# EAGLE design honeywell-mpr-breakout (EAGLE 9.3.0)
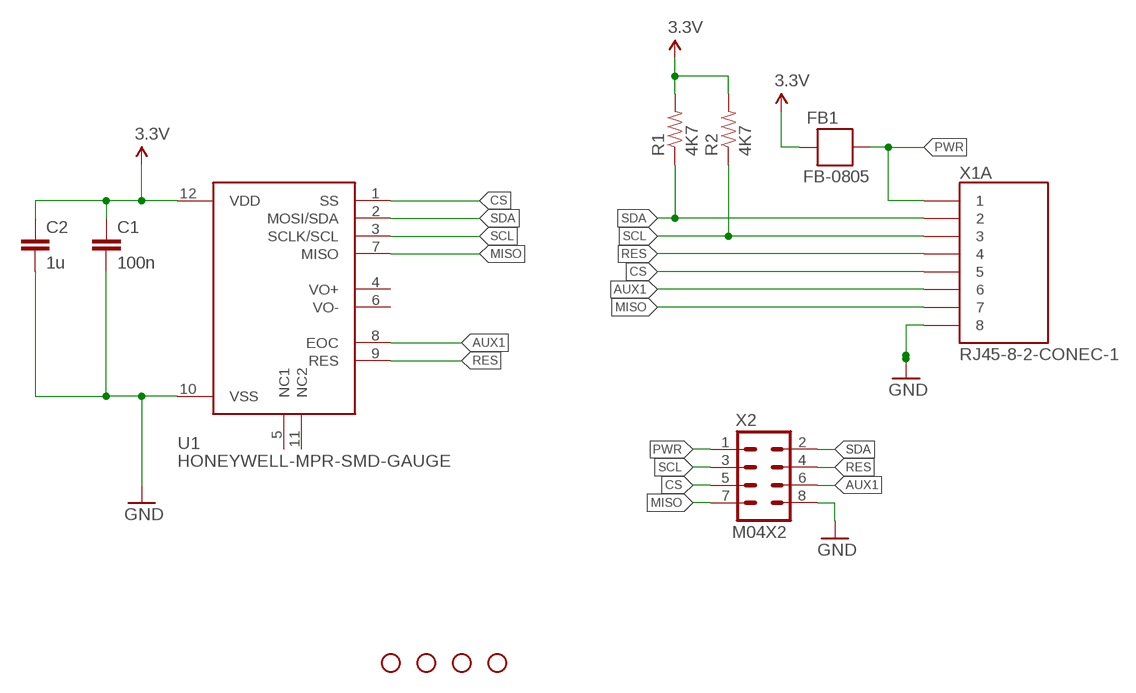
[diagram p0: schematic, sheet 1]

## Parts
C1  100n  CAP0805  [0805]
C2  1u  CAP0805  [0805]
FB1  FB-0805  [0805]
JP1  STAND-OFF  [STAND-OFF]
JP2  STAND-OFF  [STAND-OFF]
JP3  STAND-OFF  [STAND-OFF]
JP4  STAND-OFF  [STAND-OFF]
R1  4K7  RESISTOR0805-RES  [0805]
R2  4K7  RESISTOR0805-RES  [0805]
U1  HONEYWELL-MPR-SMD-GAUGE  [HONEYWELL-MPR-GAUGE]
X1  RJ45-8-2-CONEC-1  [CONEC-33TS3004ST-88001]
X2  M04X2  [2X4]

## Nets
3.3V: C1.1 C2.1 FB1.2 R1.2 R2.2 U1.12(VDD)
AUX1: U1.8(EOC) X1.6 X2.6
CS: U1.1(SS) X1.5 X2.5
GND: C1.2 C2.2 U1.10(VSS) X1.8 X1.M1 X1.M2 X2.8
MISO: U1.7(MISO) X1.7 X2.7
PWR: FB1.1 X1.1 X2.1
RES: U1.9(RES) X1.4 X2.4
SCL: R2.1 U1.3(SCLK/SCL) X1.3 X2.3
SDA: R1.1 U1.2(MOSI/SDA) X1.2 X2.2
Unconnected: U1.4(VO+) U1.5(NC1) U1.6(VO-) U1.11(NC2)

## Library data of the parts
C1 C2 = apollo-ctrl:CAP: Capacitor Standard 0603 ceramic capacitor, and 0.1" leaded capacitor.
FB1 = apollo-ctrl:FB
JP1-JP4 = apollo-ctrl:STAND-OFF: Stand Off This is the mechanical footprint for a #4 phillips button head screw. Use the keepout ring to avoid running the screw head into surrounding components. SKU : PRT-00447
R1 R2 = apollo-ctrl:RESISTOR: Resistor Basic schematic elements and footprints for 0603, 1206, and PTH resistors.
U1 = apollo-ctrl:HONEYWELL-MPR
X1 = apollo-ctrl:RJ45-8-2
X2 = apollo-ctrl:M04X2

## Board
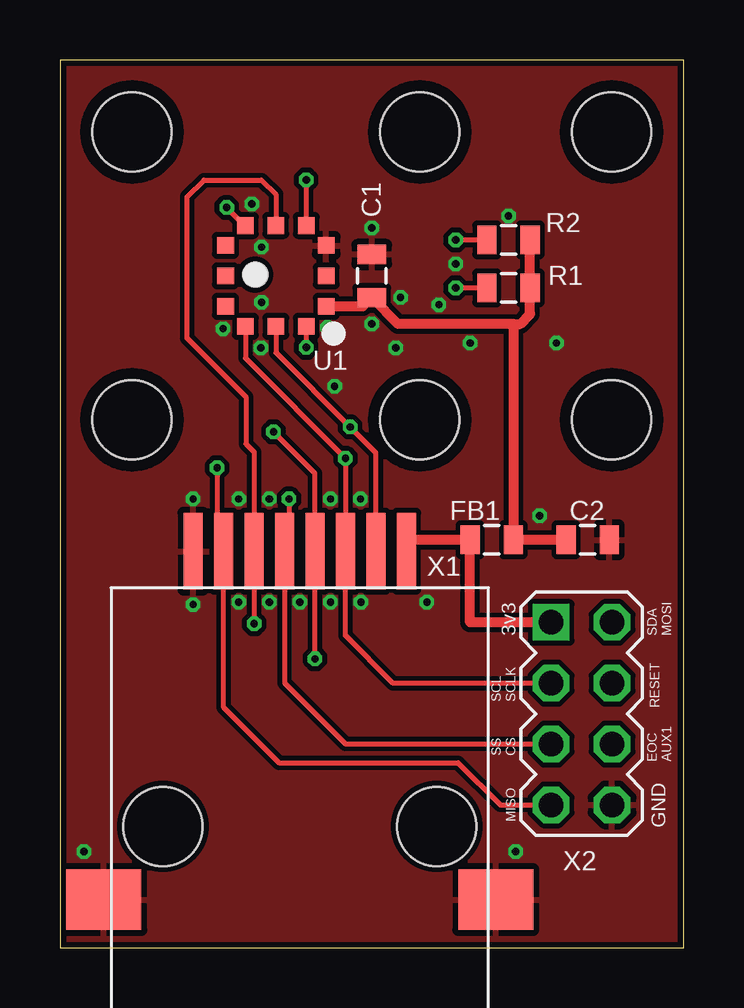
[diagram p1: board, top side]
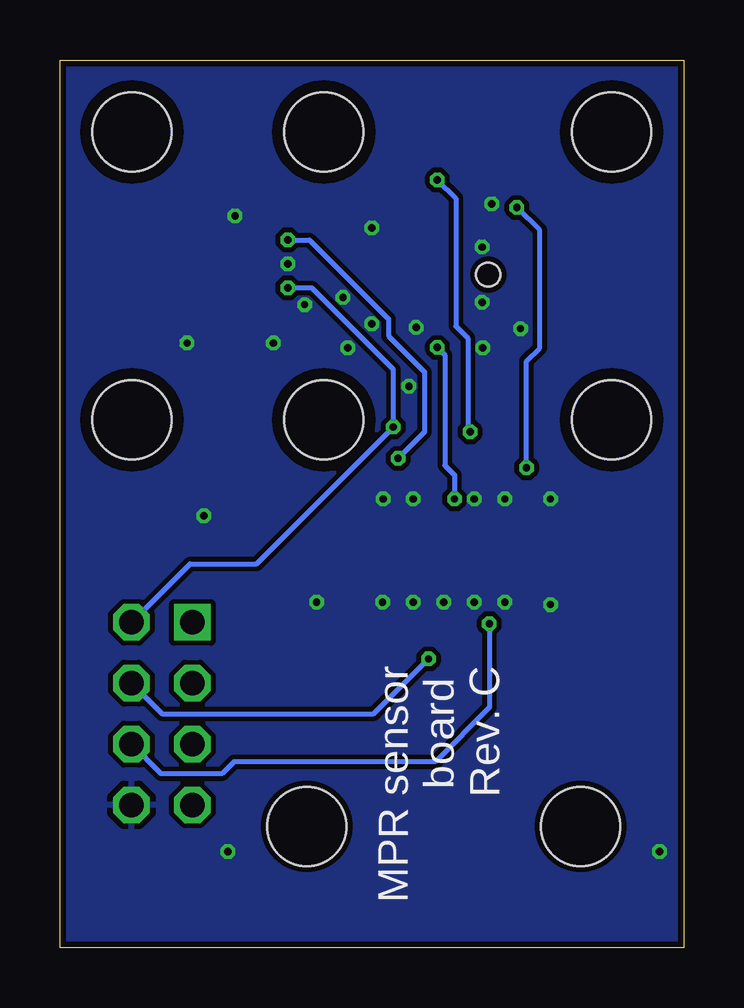
[diagram p2: board, bottom side, seen from below]

Size 26 x 37 mm. Coordinates in mm from the lower left corner, seen from the top.
Outline: 0,0 26,0 26,37 0,37 0,0
Copper layers (1*16): Top 0.035mm / dielectric 1.5mm / Bottom 0.035mm
Design rules "fusion-eagle-rule-tentedvias": minimum track width 6mil, minimum drill 0.3mm, track to track 6mil, track to pad 6mil, pad to pad 6mil, via to via 6mil, smd to smd 0mil, copper to edge 10mil, drill to drill 10mil, minimum pad ring 10mil, minimum via ring 6mil, stop-mask expansion 2mil, vias tented up to drill 25mil, thermal gap 10mil

### Footprints (pad centres in the part's own frame; a part is rotated, then mirrored left to right if it is on the bottom)
0805 = smd 0.8 x 1.2: 1 -0.9,0; 2 0.9,0
STAND-OFF = hole 3.302: 0,0
HONEYWELL-MPR-GAUGE = smd 0.7 x 0.7: 1 1.27,-2.1; 2 0,-2.1; 3 -1.27,-2.1; 4 -2.1,-1.27; 5 -2.1,0; 6 -2.1,1.27; 7 -1.27,2.1; 8 0,2.1; 9 1.27,2.1; 10 2.1,1.27; 11 2.1,0; 12 2.1,-1.27 | hole 1: -0.86,0.05
CONEC-33TS3004ST-88001 = smd 0.8 x 3.2: 1 -4.445,-14.52; 2 -3.175,-14.52; 3 -1.905,-14.52; 4 -0.635,-14.52; 5 0.635,-14.52; 6 1.905,-14.52; 7 3.175,-14.52; 8 4.445,-14.52 | smd 3.12 x 2.54: M1 -8.17,0; M2 8.17,0 | hole 3.3: -5.715,-3.05; 5.715,-3.05
2X4 = drill 1.016 square: 1 -3.81,-1.27 | drill 1.016 octagon: 2 -3.81,1.27; 3 -1.27,-1.27; 4 -1.27,1.27; 5 1.27,-1.27; 6 1.27,1.27; 7 3.81,-1.27; 8 3.81,1.27

### Placement (x,y rotation side)
C1  13,28 90 top
C2  22,17 0 top
FB1  18,17 0 top
JP1  3,34 0 top
JP2  15,34 0 top
JP3  3,22 0 top
JP4  15,22 0 top
JP5  STAND-OFF  [STAND-OFF]  23,34 0 top
JP6  STAND-OFF  [STAND-OFF]  23,22 0 top
R1  18.7,27.5 0 top
R2  18.7,29.5 0 top
U1  9,28 0 top
X1  10,2 180 top
X2  21.75,9.75 270 top

### Tracks (layer width: path | path; a pad name or v marks a point on that pad's centre or on a via)
3.3V
  Top 0.406: U1.12 12.63,26.73 C1.1 14.1,26 18.9,26 | 18.9,26 FB1.2 C2.1 | 18.9,26 19.19,26 19.6,26.41 R1.2 R2.2
AUX1  (via drill 0.3)
  Top 0.203: U1.8 9,31.4 8.4,32 6,32 5.3,31.3 5.3,25.4 7.75,22.95 7.75,21 8.1,20.66 X1.6 v8.1,13.5
  Bottom 0.203: v8.1,13.5 8.1,10 10.35,7.75 18.75,7.75 19.25,7.25 21.79,7.25 X2.6
CS  (via drill 0.3)
  Top 0.203: X2.5 11.91,8.48 9.37,11.03 X1.5 9.55,16.52 v9.55,18.7 | U1.1 v10.27,25.02
  Bottom 0.203: v10.27,25.02 9.95,24.7 9.95,20.1 9.55,19.7 v9.55,18.7
GND  (via drill 0.3)
  other vias: 13,30 8.4,26.9 8.4,29.2 8,31 11.28,18.7 12.53,18.7 8.38,25 20,18 8.72,18.7 8.72,14.4 7.45,14.4 5.55,14.3 5.55,18.7 10,14.4 11.28,14.4 12.55,14.4 14,25 6.8,25.8 18.7,30.5 15.3,14.4 1,4 19,4 16.5,28.5 7.45,18.7 11.45,23.4 13,26 14.2,27.1 15.8,26.8 17.1,25.2 20.7,25.2 11.15,25.85
  pour Top (isolate 0.203): 0,0 26,0 26,37 0,37
  pour Bottom (isolate 0.203): 0,0 26,0 26,37 0,37
MISO  (via drill 0.3)
  Top 0.203: X2.7 18.36,5.94 16.6,7.7 9.13,7.7 6.83,10.01 X1.7 6.55,16.52 v6.55,20 | U1.7 7.7,30.1 v6.95,30.85
  Bottom 0.203: v6.55,20 6.55,24.45 6,25 6,29.9 v6.95,30.85
PWR
  Top 0.406: X1.1 14.45,17 FB1.1 17.1,13.56 X2.1
RES  (via drill 0.3)
  Top 0.203: v8.9,21.5 10.63,19.77 X1.4 v10.63,12.03 | v10.27,32 U1.9
  Bottom 0.203: v10.27,32 9.5,31.23 9.5,25.9 9,25.4 9,21.6 v8.9,21.5 | X2.4 21.75,9.75 12.92,9.75 v10.63,12.03
SCL  (via drill 0.3)
  Top 0.203: U1.3 7.73,24.57 v11.9,20.39 X1.3 11.9,13 13.89,11.02 X2.3 | R2.1 v16.5,29.5
  Bottom 0.203: v16.5,29.5 15.6,29.5 12.3,26.2 12.3,25.5 10.8,24 10.8,21.5 v11.9,20.39
SDA  (via drill 0.3)
  Top 0.203: X1.2 13.18,20.62 v12.1,21.7 9,24.8 U1.2 | R1.1 v16.5,27.5
  Bottom 0.203: v16.5,27.5 15.5,27.5 12.1,24.1 v12.1,21.7 17.8,16 20.58,16 X2.2

### Text on the board
tNames: 3v3 | SDA / MOSI | SCL / SCLK | RESET | SS / CS | EOC / AUX1 | MISO | GND
bNames: MPR sensor / board / Rev. C